# EAGLE design Register (EAGLE 9.6.2)
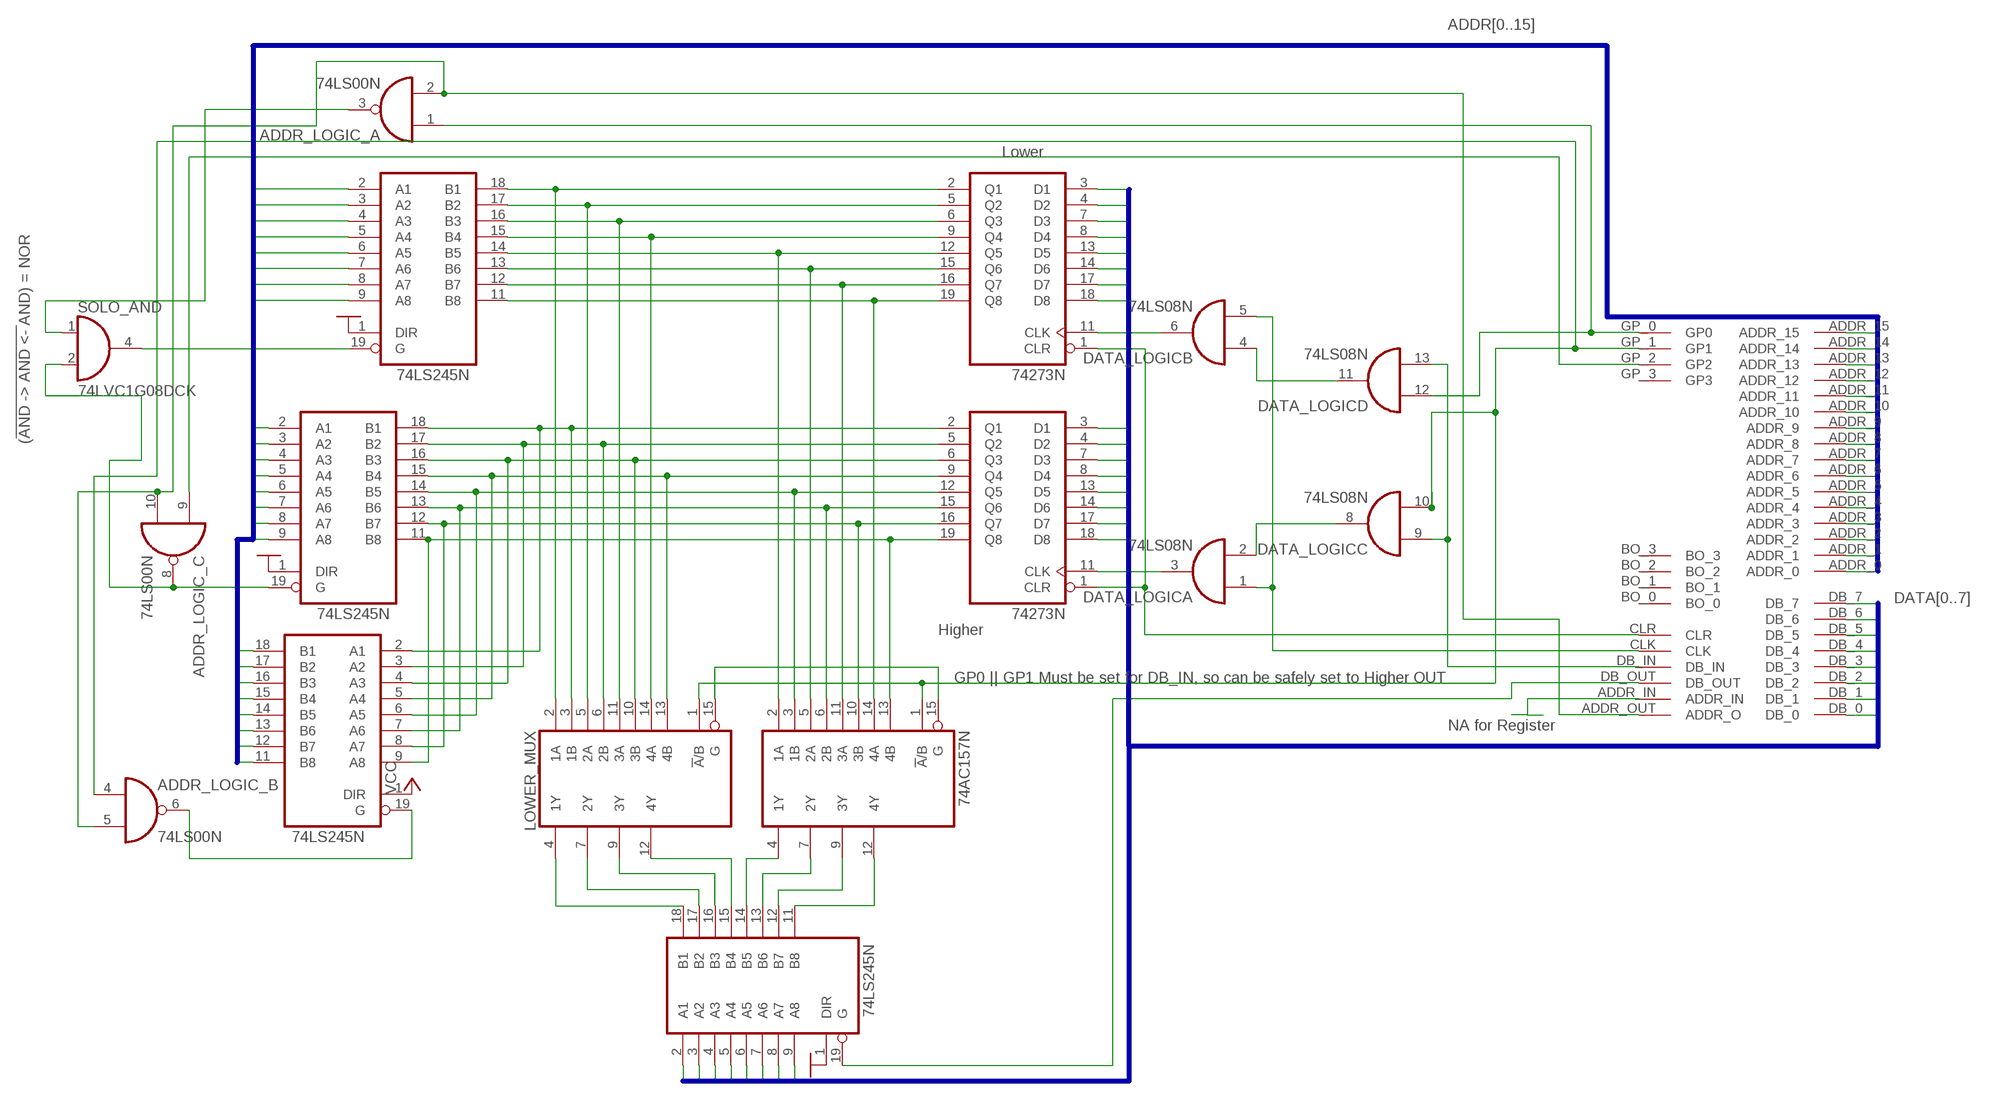
[diagram p0: schematic, sheet 1]

## Parts
ADDR_HIGHER_BUFFER  74LS245N  [DIL20]
ADDR_HIGHER_TO_LOWER  74LS245N  [DIL20]
ADDR_LOGIC_  74LS00N  [DIL14]
ADDR_LOWER_BUFFER  74LS245N  [DIL20]
DATA_LOGIC  74LS08N  [DIL14]
DATA_OUTPUT_BUFFER  74LS245N  [DIL20]
HIGHER_MUX  74AC157N  [DIL16]
LOWER_MUX  74AC157N  [DIL16]
REG_HIGHER  74273N  [DIL20]
REG_LOWER  74273N  [DIL20]
SOLO_AND  74LVC1G08DCK  [SC70-5]
U$1  BACKPLATE_INTERFACEEDGE_FINGER  [BACK_INTERFACE-FOOT]

## Nets
ADDR0: ADDR_HIGHER_TO_LOWER.18(B1) ADDR_LOWER_BUFFER.2(A1) U$1.ADDR_0
ADDR1: ADDR_HIGHER_TO_LOWER.17(B2) ADDR_LOWER_BUFFER.3(A2) U$1.ADDR_1
ADDR2: ADDR_HIGHER_TO_LOWER.16(B3) ADDR_LOWER_BUFFER.4(A3) U$1.ADDR_2
ADDR3: ADDR_HIGHER_TO_LOWER.15(B4) ADDR_LOWER_BUFFER.5(A4) U$1.ADDR_3
ADDR4: ADDR_HIGHER_TO_LOWER.14(B5) ADDR_LOWER_BUFFER.6(A5) U$1.ADDR_4
ADDR5: ADDR_HIGHER_TO_LOWER.13(B6) ADDR_LOWER_BUFFER.7(A6) U$1.ADDR_5
ADDR6: ADDR_HIGHER_TO_LOWER.12(B7) ADDR_LOWER_BUFFER.8(A7) U$1.ADDR_6
ADDR7: ADDR_HIGHER_TO_LOWER.11(B8) ADDR_LOWER_BUFFER.9(A8) U$1.ADDR_7
ADDR8: ADDR_HIGHER_BUFFER.2(A1) U$1.ADDR_8
ADDR9: ADDR_HIGHER_BUFFER.3(A2) U$1.ADDR_9
ADDR10: ADDR_HIGHER_BUFFER.4(A3) U$1.ADDR_10
ADDR11: ADDR_HIGHER_BUFFER.5(A4) U$1.ADDR_11
ADDR12: ADDR_HIGHER_BUFFER.6(A5) U$1.ADDR_12
ADDR13: ADDR_HIGHER_BUFFER.7(A6) U$1.ADDR_13
ADDR14: ADDR_HIGHER_BUFFER.8(A7) U$1.ADDR_14
ADDR15: ADDR_HIGHER_BUFFER.9(A8) U$1.ADDR_15
CLK: DATA_LOGIC.1(A:I0) DATA_LOGIC.5(B:I1) U$1.CLK
CLR: REG_HIGHER.1(CLR) REG_LOWER.1(CLR) U$1.CLR
CTRL_ADDR_OUT: ADDR_LOGIC_.2(A:I1) ADDR_LOGIC_.5(B:I1) ADDR_LOGIC_.10(C:I1) U$1.ADDR_OUT(ADDR_O)
CTRL_DB_IN: DATA_LOGIC.9(C:I0) DATA_LOGIC.13(D:I1) U$1.DB_IN
CTRL_DB_OUT: DATA_OUTPUT_BUFFER.19(G) U$1.DB_OUT
DATA0: DATA_OUTPUT_BUFFER.2(A1) REG_HIGHER.3(D1) REG_LOWER.3(D1) U$1.DB_0
DATA1: DATA_OUTPUT_BUFFER.3(A2) REG_HIGHER.4(D2) REG_LOWER.4(D2) U$1.DB_1
DATA2: DATA_OUTPUT_BUFFER.4(A3) REG_HIGHER.7(D3) REG_LOWER.7(D3) U$1.DB_2
DATA3: DATA_OUTPUT_BUFFER.5(A4) REG_HIGHER.8(D4) REG_LOWER.8(D4) U$1.DB_3
DATA4: DATA_OUTPUT_BUFFER.6(A5) REG_HIGHER.13(D5) REG_LOWER.13(D5) U$1.DB_4
DATA5: DATA_OUTPUT_BUFFER.7(A6) REG_HIGHER.14(D6) REG_LOWER.14(D6) U$1.DB_5
DATA6: DATA_OUTPUT_BUFFER.8(A7) REG_HIGHER.17(D7) REG_LOWER.17(D7) U$1.DB_6
DATA7: DATA_OUTPUT_BUFFER.9(A8) REG_HIGHER.18(D8) REG_LOWER.18(D8) U$1.DB_7
DATA_0: ADDR_LOWER_BUFFER.18(B1) LOWER_MUX.2(1A) REG_LOWER.2(Q1)
DATA_1: ADDR_LOWER_BUFFER.17(B2) LOWER_MUX.5(2A) REG_LOWER.5(Q2)
DATA_2: ADDR_LOWER_BUFFER.16(B3) LOWER_MUX.11(3A) REG_LOWER.6(Q3)
DATA_3: ADDR_LOWER_BUFFER.15(B4) LOWER_MUX.14(4A) REG_LOWER.9(Q4)
DATA_4: ADDR_LOWER_BUFFER.14(B5) HIGHER_MUX.2(1A) REG_LOWER.12(Q5)
DATA_5: ADDR_LOWER_BUFFER.13(B6) HIGHER_MUX.5(2A) REG_LOWER.15(Q6)
DATA_6: ADDR_LOWER_BUFFER.12(B7) HIGHER_MUX.11(3A) REG_LOWER.16(Q7)
DATA_7: ADDR_LOWER_BUFFER.11(B8) HIGHER_MUX.14(4A) REG_LOWER.19(Q8)
DATA_8: ADDR_HIGHER_BUFFER.18(B1) ADDR_HIGHER_TO_LOWER.2(A1) LOWER_MUX.3(1B) REG_HIGHER.2(Q1)
DATA_9: ADDR_HIGHER_BUFFER.17(B2) ADDR_HIGHER_TO_LOWER.3(A2) LOWER_MUX.6(2B) REG_HIGHER.5(Q2)
DATA_10: ADDR_HIGHER_BUFFER.16(B3) ADDR_HIGHER_TO_LOWER.4(A3) LOWER_MUX.10(3B) REG_HIGHER.6(Q3)
DATA_11: ADDR_HIGHER_BUFFER.15(B4) ADDR_HIGHER_TO_LOWER.5(A4) LOWER_MUX.13(4B) REG_HIGHER.9(Q4)
DATA_12: ADDR_HIGHER_BUFFER.14(B5) ADDR_HIGHER_TO_LOWER.6(A5) HIGHER_MUX.3(1B) REG_HIGHER.12(Q5)
DATA_13: ADDR_HIGHER_BUFFER.13(B6) ADDR_HIGHER_TO_LOWER.7(A6) HIGHER_MUX.6(2B) REG_HIGHER.15(Q6)
DATA_14: ADDR_HIGHER_BUFFER.12(B7) ADDR_HIGHER_TO_LOWER.8(A7) HIGHER_MUX.10(3B) REG_HIGHER.16(Q7)
DATA_15: ADDR_HIGHER_BUFFER.11(B8) ADDR_HIGHER_TO_LOWER.9(A8) HIGHER_MUX.13(4B) REG_HIGHER.19(Q8)
GND: ADDR_HIGHER_BUFFER.1(DIR) ADDR_LOWER_BUFFER.1(DIR) DATA_OUTPUT_BUFFER.1(DIR)
GP_0: ADDR_LOGIC_.1(A:I0) DATA_LOGIC.12(D:I0) U$1.GP_0(GP0)
GP_1: ADDR_LOGIC_.4(B:I0) DATA_LOGIC.10(C:I1) HIGHER_MUX.1(!A!/B) LOWER_MUX.1(!A!/B) U$1.GP_1(GP1)
GP_2: ADDR_LOGIC_.9(C:I0) U$1.GP_2(GP2)
N$2: DATA_OUTPUT_BUFFER.18(B1) LOWER_MUX.4(1Y)
N$3: DATA_OUTPUT_BUFFER.17(B2) LOWER_MUX.7(2Y)
N$4: DATA_LOGIC.6(B:O) REG_LOWER.11(CLK)
N$5: DATA_LOGIC.3(A:O) REG_HIGHER.11(CLK)
N$6: DATA_LOGIC.4(B:I0) DATA_LOGIC.11(D:O)
N$7: DATA_LOGIC.2(A:I1) DATA_LOGIC.8(C:O)
N$24: DATA_OUTPUT_BUFFER.16(B3) LOWER_MUX.9(3Y)
N$26: DATA_OUTPUT_BUFFER.15(B4) LOWER_MUX.12(4Y)
N$28: DATA_OUTPUT_BUFFER.14(B5) HIGHER_MUX.4(1Y)
N$29: U$1.ADDR_IN
N$30: DATA_OUTPUT_BUFFER.13(B6) HIGHER_MUX.7(2Y)
N$31: DATA_OUTPUT_BUFFER.12(B7) HIGHER_MUX.9(3Y)
N$32: DATA_OUTPUT_BUFFER.11(B8) HIGHER_MUX.12(4Y)
N$34: ADDR_HIGHER_TO_LOWER.19(G) ADDR_LOGIC_.6(B:O)
N$35: HIGHER_MUX.15(G) LOWER_MUX.15(G)
N$38: ADDR_HIGHER_BUFFER.19(G) ADDR_LOGIC_.8(C:O) SOLO_AND.2(I1)
N$39: ADDR_LOGIC_.3(A:O) SOLO_AND.1(I0)
N$41: ADDR_LOWER_BUFFER.19(G) SOLO_AND.4(O)
VCC: ADDR_HIGHER_TO_LOWER.1(DIR)
Unconnected: ADDR_LOGIC_.11(D:O) ADDR_LOGIC_.12(D:I0) ADDR_LOGIC_.13(D:I1) U$1.BO_0 U$1.BO_1 U$1.BO_2 U$1.BO_3 U$1.GP_3(GP3) U$1.NC_0 U$1.NC_1 U$1.NC_2 U$1.NC_3 U$1.NC_4 U$1.NC_5 U$1.NC_6 U$1.NC_7 U$1.NC_8 U$1.NC_9 U$1.NC_10 U$1.NC_11 U$1.NC_12 U$1.NC_13 U$1.NC_14 U$1.NC_15 U$1.NC_16 U$1.NC_17 U$1.NC_18 U$1.NC_19 U$1.NC_20 U$1.NC_21

## Buses
DATA[0..7]
ADDR[0..15]

## Notes on the sheet
- Lower
- (!AND -> AND <- !AND) = NOR
- Higher
- GP0 || GP1 Must be set for DB_IN, so can be safely set to Higher OUT
- NA for Register

## Power pins joined to a net without a drawn wire
GND: ADDR_HIGHER_BUFFER.10(GND) ADDR_HIGHER_TO_LOWER.10(GND) ADDR_LOGIC_.7(P:GND) ADDR_LOWER_BUFFER.10(GND) DATA_LOGIC.7(P:GND) DATA_OUTPUT_BUFFER.10(GND) HIGHER_MUX.8(GND) LOWER_MUX.8(GND) REG_HIGHER.10(GND) REG_LOWER.10(GND) SOLO_AND.3(GND) U$1.GND_0(GND) U$1.GND_1(GND)
VCC: ADDR_HIGHER_BUFFER.20(VCC) ADDR_HIGHER_TO_LOWER.20(VCC) ADDR_LOGIC_.14(P:VCC) ADDR_LOWER_BUFFER.20(VCC) DATA_LOGIC.14(P:VCC) DATA_OUTPUT_BUFFER.20(VCC) HIGHER_MUX.16(VCC) LOWER_MUX.16(VCC) REG_HIGHER.20(VCC) REG_LOWER.20(VCC) SOLO_AND.5(VCC) U$1.VCC_0(VCC) U$1.VCC_1(VCC)

## Library data of the parts
ADDR_HIGHER_BUFFER ADDR_HIGHER_TO_LOWER ADDR_LOWER_BUFFER DATA_OUTPUT_BUFFER = 74xx-eu:74*245: Octal BUS TRANSCEIVER, 3-state
ADDR_LOGIC_ = 74xx-eu:74*00: Quad 2-input NAND gate
DATA_LOGIC = 74xx-eu:74*08: Quad 2-input AND gate
HIGHER_MUX LOWER_MUX = 74xx-eu:74*157: Quadruple 2-line to 1-line data SELECTOR/MULTIPLEXER
REG_HIGHER REG_LOWER = 74xx-eu:74*273: Octal D type FLIP FLOP, clear
SOLO_AND = 74xx-little-de:74*1G08: 2-input AND gate
U$1 = Computer:BACKPLATE_INTERFACE

## Board
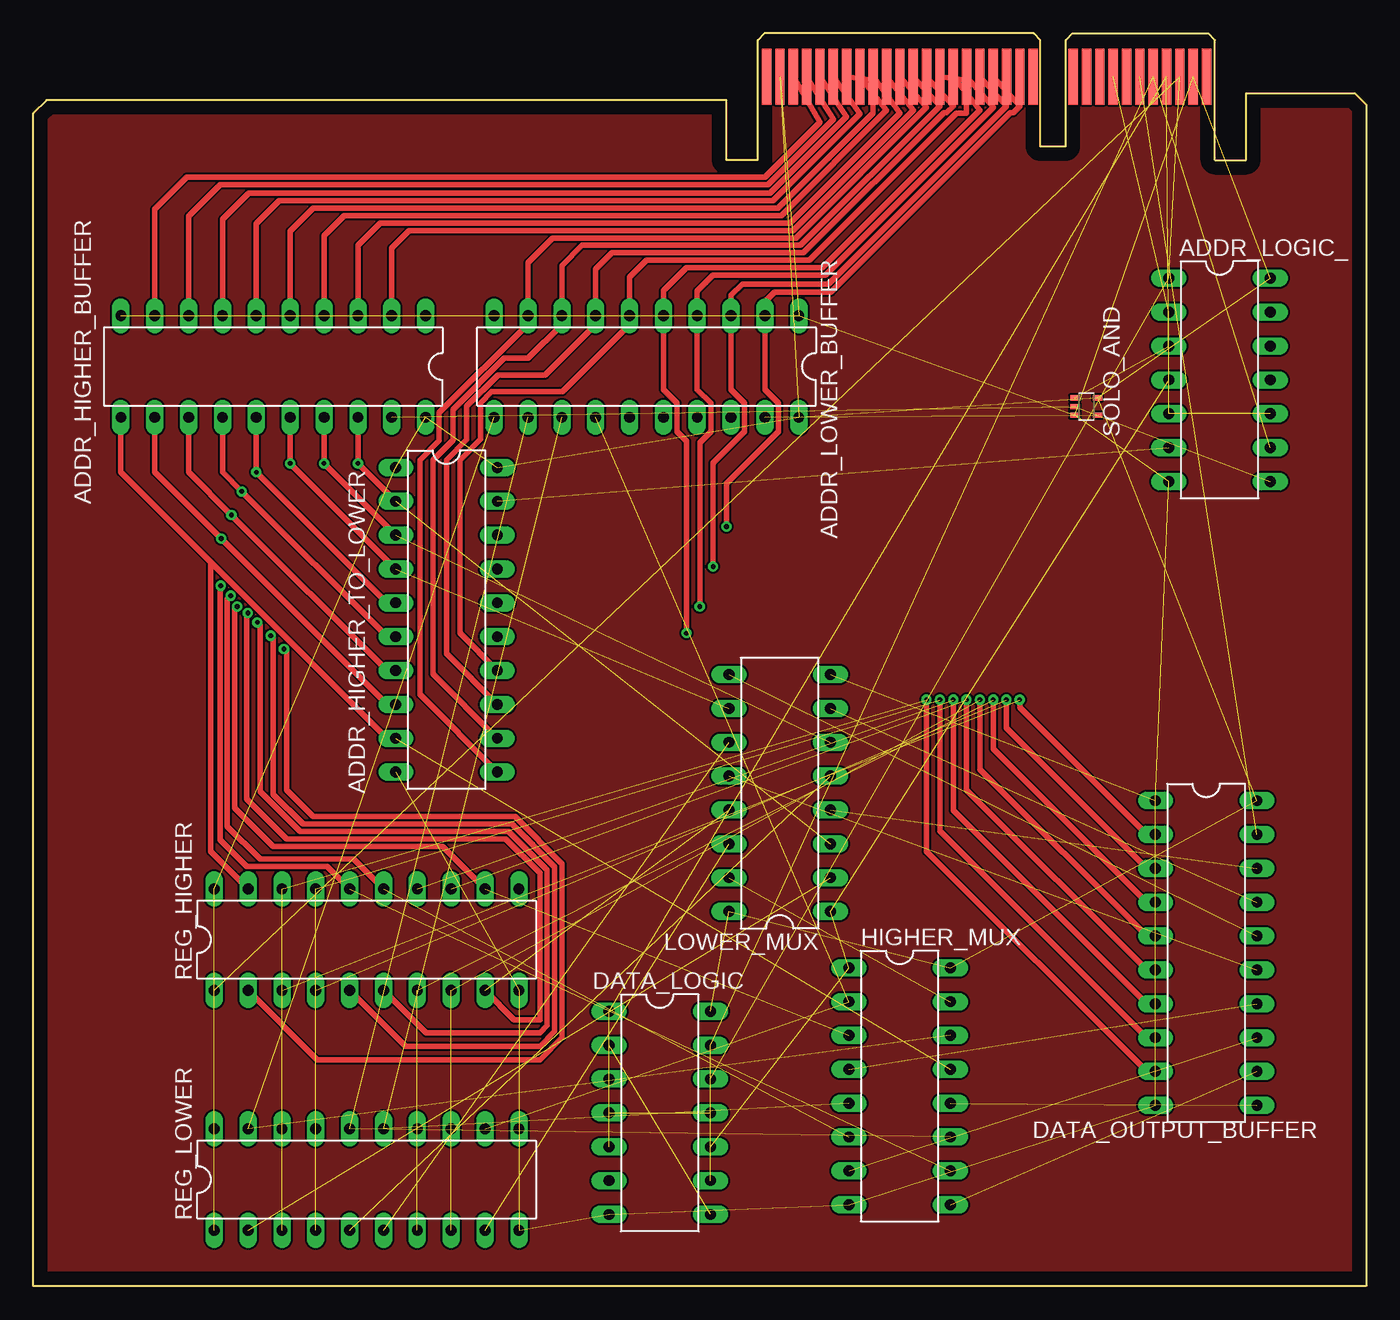
[diagram p1: board, top side]
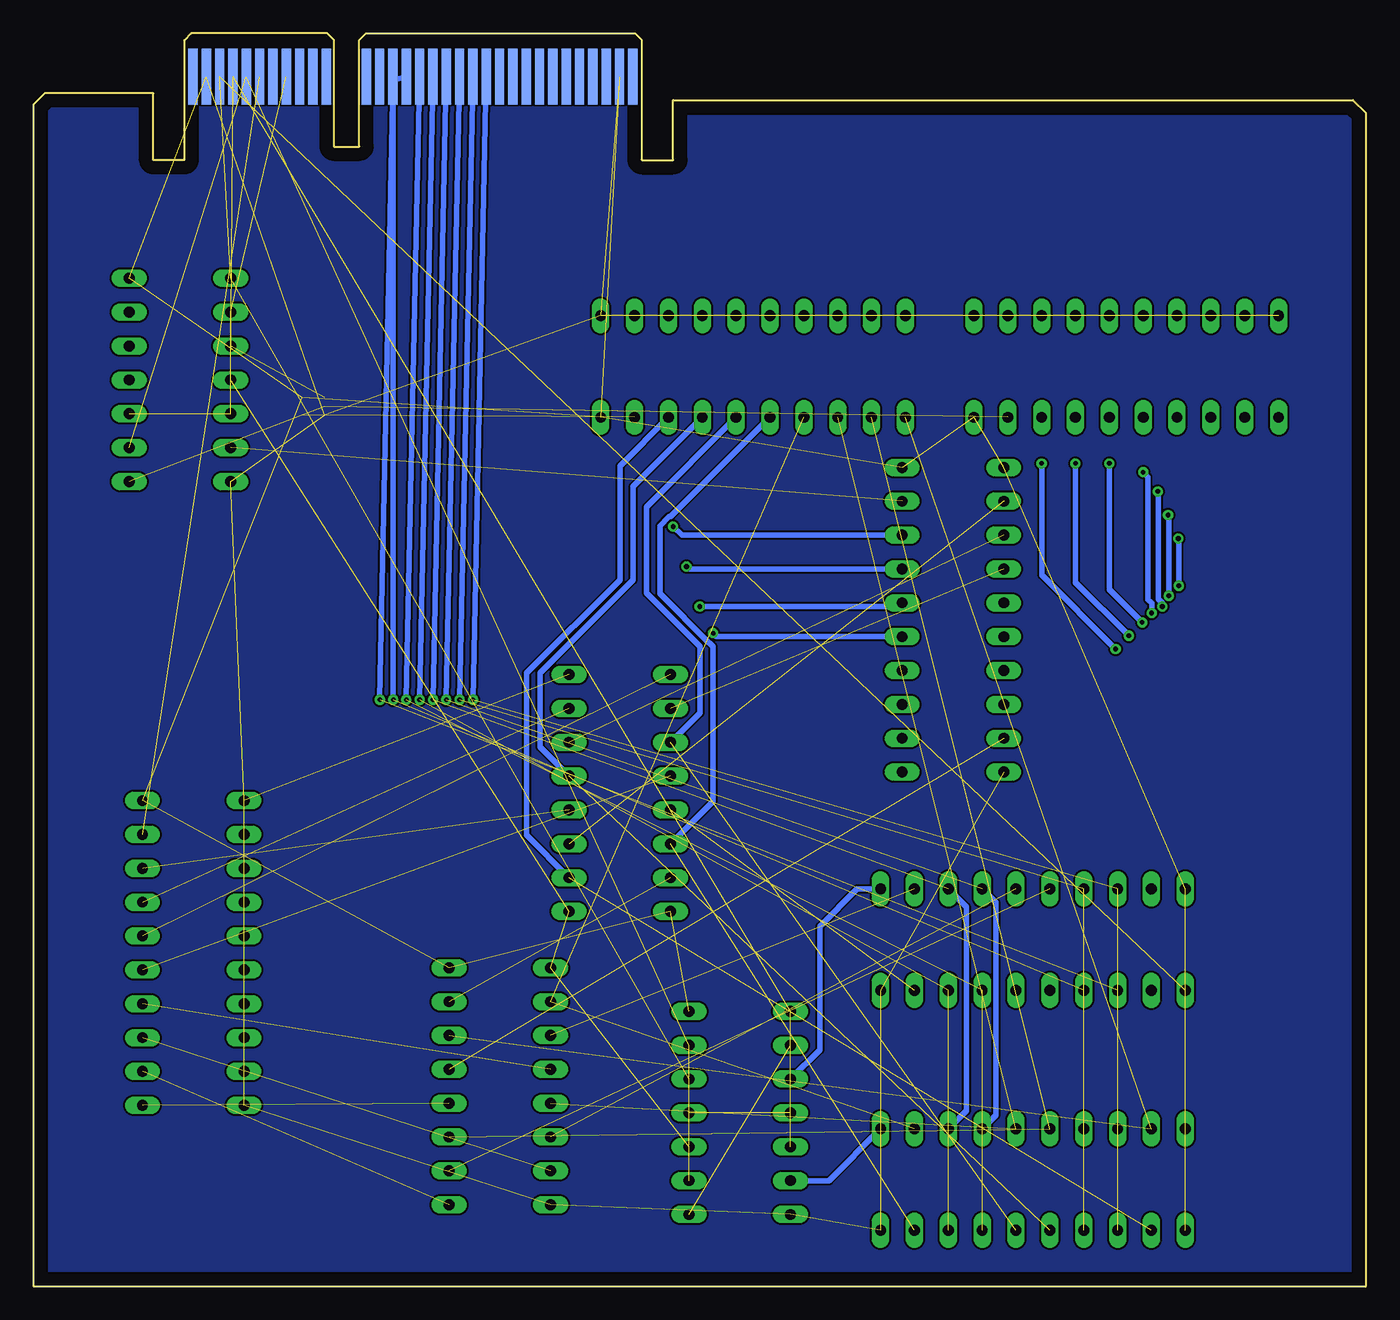
[diagram p2: board, bottom side, seen from below]

Size 100 x 94 mm. Coordinates in mm from the lower left corner, seen from the top.
Outline: 0,0 0,88 1,89 52,89 52,84.5 54.35,84.5 54.35,93.5 54.85,94 75.05,94 75.55,93.5 75.55,85.5 77.45,85.5 77.45,93.5 77.95,94 88.15,94 88.65,93.5 88.65,84.5 91,84.5 91,89.5 99.15,89.5 100,88.65 100,0 0,0
Copper layers (1+2*15+16): Top 0.035mm / dielectric 1.5mm / Route2 0.035mm / dielectric 0.15mm / Route15 0.035mm / dielectric 0.2mm / Bottom 0.035mm
Design rules "default *": minimum track width 16mil, minimum drill 0.35mm, track to track 6mil, track to pad 6mil, pad to pad 6mil, via to via 6mil, smd to smd 6mil, copper to edge 40mil, drill to drill 6mil, minimum pad ring 10mil, minimum via ring 8mil, stop-mask expansion 4mil, vias tented up to drill 0mil, thermal gap 10mil

### Footprints (pad centres in the part's own frame; a part is rotated, then mirrored left to right if it is on the bottom)
DIL20 = drill 0.813 long: 1 -11.43,-3.81; 2 -8.89,-3.81; 3 -6.35,-3.81; 4 -3.81,-3.81; 5 -1.27,-3.81; 6 1.27,-3.81; 7 3.81,-3.81; 8 6.35,-3.81; 9 8.89,-3.81; 10 11.43,-3.81; 11 11.43,3.81; 12 8.89,3.81; 13 6.35,3.81; 14 3.81,3.81; 15 1.27,3.81; 16 -1.27,3.81; 17 -3.81,3.81; 18 -6.35,3.81; 19 -8.89,3.81; 20 -11.43,3.81
DIL14 = drill 0.813 long: 1 -7.62,-3.81; 2 -5.08,-3.81; 3 -2.54,-3.81; 4 0,-3.81; 5 2.54,-3.81; 6 5.08,-3.81; 7 7.62,-3.81; 8 7.62,3.81; 9 5.08,3.81; 10 2.54,3.81; 11 0,3.81; 12 -2.54,3.81; 13 -5.08,3.81; 14 -7.62,3.81
DIL16 = drill 0.813 long: 1 -8.89,-3.81; 2 -6.35,-3.81; 3 -3.81,-3.81; 4 -1.27,-3.81; 5 1.27,-3.81; 6 3.81,-3.81; 7 6.35,-3.81; 8 8.89,-3.81; 9 8.89,3.81; 10 6.35,3.81; 11 3.81,3.81; 12 1.27,3.81; 13 -1.27,3.81; 14 -3.81,3.81; 15 -6.35,3.81; 16 -8.89,3.81
SC70-5 = smd 0.4 x 0.7: 1 -0.65,-0.85; 2 0,-0.85; 3 0.65,-0.85; 4 0.65,0.85; 5 -0.65,0.85
BACK_INTERFACE-FOOT = smd 0.7 x 4.2: ADDR_0 17.02,0; ADDR_1 16.02,0; ADDR_2 15.02,0; ADDR_3 14.02,0; ADDR_4 13.02,0; ADDR_5 12.02,0; ADDR_6 11.02,0; ADDR_7 10.02,0; ADDR_8 9.02,0; ADDR_9 8.02,0; ADDR_10 7.02,0; ADDR_11 6.02,0; ADDR_12 5.02,0; ADDR_13 4.02,0; ADDR_14 3.02,0; ADDR_15 2.02,0; ADDR_IN 27.02,0; ADDR_OUT 26.02,0; CLK 30.02,0; CLR 31.02,0; DB_IN 29.02,0; DB_OUT 28.02,0; GND_0 32.02,0; GND_1 1.02,0; NC_0 33.02,0; NC_1 25.02,0; NC_2 24.02,0; NC_3 23.02,0; NC_4 20.02,0; NC_5 19.02,0; NC_6 18.02,0; NC_7 0.02,0 | smd 0.7 x 4.2 bottom: BO_0 27.02,0; BO_1 26.02,0; BO_2 25.02,0; BO_3 24.02,0; DB_0 18.02,0; DB_1 17.02,0; DB_2 16.02,0; DB_3 15.02,0; DB_4 14.02,0; DB_5 13.02,0; DB_6 12.02,0; DB_7 11.02,0; GP_0 31.02,0; GP_1 30.02,0; GP_2 29.02,0; GP_3 28.02,0; NC_8 33.02,0; NC_9 23.02,0; NC_10 20.02,0; NC_11 19.02,0; NC_12 10.02,0; NC_13 9.02,0; NC_14 8.02,0; NC_15 7.02,0; NC_16 6.02,0; NC_17 5.02,0; NC_18 4.02,0; NC_19 3.02,0; NC_20 2.02,0; NC_21 0.02,0; VCC_0 32.02,0; VCC_1 1.02,0

### Placement (x,y rotation side)
ADDR_HIGHER_BUFFER  18,69 180 top
ADDR_HIGHER_TO_LOWER  31,50 270 top
ADDR_LOGIC_  89,68 270 top
ADDR_LOWER_BUFFER  46,69 180 top
DATA_LOGIC  47,13 270 top
DATA_OUTPUT_BUFFER  88,25 270 top
HIGHER_MUX  65,15 270 top
LOWER_MUX  56,37 90 top
REG_HIGHER  25,26 0 top
REG_LOWER  25,8 0 top
SOLO_AND  79,66 270 top
U$1  55,90.75 0 top

### Tracks (layer width: path | path; a pad name or v marks a point on that pad's centre or on a via)
ADDR0  (via drill 0.35)
  Top 0.406: U$1.ADDR_0 74.02,88.55 73.52,88.04 73.31,88.04 59.85,74.59 55.59,74.59 55,74 55,72.92 ADDR_LOWER_BUFFER.2 54.89,67.29 55.91,66.27 55.91,64.11 52,60.2 v52,57
  Bottom 0.406: v52,57 51.35,56.35 ADDR_HIGHER_TO_LOWER.18
ADDR1  (via drill 0.35)
  Top 0.406: U$1.ADDR_1 73.02,88.55 59.67,75.2 53.2,75.2 52.35,74.35 ADDR_LOWER_BUFFER.3 52.35,67.29 53.37,66.27 53.37,64.11 51,61.74 v51,54
  Bottom 0.406: v51,54 50.81,53.81 ADDR_HIGHER_TO_LOWER.17
ADDR2  (via drill 0.35)
  Top 0.406: U$1.ADDR_2 72.02,88.44 59.43,75.85 51,75.85 49.81,74.66 ADDR_LOWER_BUFFER.4 49.81,67.29 50.83,66.27 50.83,64.11 50,63.28 v50,51
  Bottom 0.406: v50,51 35.08,51 ADDR_HIGHER_TO_LOWER.16
ADDR3  (via drill 0.35)
  Top 0.406: U$1.ADDR_3 71.02,88.23 59.2,76.41 49,76.41 47.27,74.68 ADDR_LOWER_BUFFER.5 47.27,67.29 48.29,66.27 48.29,64.11 49,63.4 v49,49
  Bottom 0.406: v49,49 48.73,48.73 ADDR_HIGHER_TO_LOWER.15
ADDR4
  Top 0.406: U$1.ADDR_4 70,90.48 70,88 69.26,88 58.23,76.97 46,76.97 44.73,75.7 ADDR_LOWER_BUFFER.6 44.73,72.15 39.69,67.11 34.39,67.11 33.54,66.26 33.54,63.54 32,62 32,49 ADDR_HIGHER_TO_LOWER.14
ADDR5
  Top 0.406: U$1.ADDR_5 69.02,88.55 68.52,88.04 68.31,88.04 57.79,77.53 43.41,77.53 42.19,76.31 ADDR_LOWER_BUFFER.7 42.19,72.15 38.41,68.37 34.86,68.37 32.51,66.02 32.51,63.51 31,62 31,47.46 ADDR_HIGHER_TO_LOWER.13
ADDR6
  Top 0.406: U$1.ADDR_6 68.02,88.55 57.56,78.09 41.18,78.09 39.65,76.56 ADDR_LOWER_BUFFER.8 39.65,72.15 37.13,69.63 35.33,69.63 31.49,65.78 31.49,63.49 30,62 30,45.92 ADDR_HIGHER_TO_LOWER.12
ADDR7
  Top 0.406: U$1.ADDR_7 67.02,88.44 57.23,78.65 38.95,78.65 37.11,76.81 ADDR_LOWER_BUFFER.9 37.11,72.2 30.46,65.55 30.46,63.46 29,62 29,44.38 ADDR_HIGHER_TO_LOWER.11
ADDR8
  Top 0.406: ADDR_HIGHER_BUFFER.2 26.89,77.89 28.21,79.21 57,79.21 66.02,88.23 U$1.ADDR_8
ADDR9
  Top 0.406: U$1.ADDR_9 65.02,88.02 56.77,79.77 26,79.77 24.35,78.11 ADDR_HIGHER_BUFFER.3
ADDR10
  Top 0.406: ADDR_HIGHER_BUFFER.4 21.81,78.81 23.32,80.32 56.11,80.32 64.02,88.23 U$1.ADDR_10
ADDR11
  Top 0.406: U$1.ADDR_11 63,90.48 63,88 55.88,80.88 21,80.88 19.27,79.15 ADDR_HIGHER_BUFFER.5
ADDR12
  Top 0.406: ADDR_HIGHER_BUFFER.6 16.73,79.73 18.44,81.44 55.49,81.44 62.02,87.97 U$1.ADDR_12
ADDR13
  Top 0.406: U$1.ADDR_13 61.02,87.76 55.26,82 16.14,82 14.19,80.05 ADDR_HIGHER_BUFFER.7
ADDR14
  Top 0.406: ADDR_HIGHER_BUFFER.8 11.65,80.3 14,82.65 55.12,82.65 60.02,87.55 U$1.ADDR_14
ADDR15
  Top 0.406: ADDR_HIGHER_BUFFER.9 9.11,80.81 11.51,83.2 54.89,83.2 59.02,87.34 U$1.ADDR_15
CLK  (2 unrouted)
CLR  (2 unrouted)
CTRL_ADDR_OUT  (3 unrouted)
CTRL_DB_IN  (2 unrouted)
CTRL_DB_OUT  (1 unrouted)
DATA0  (via drill 0.35)  (2 unrouted)
  Top 0.406: DATA_OUTPUT_BUFFER.2 83.53,33.89 74,43.42 v74,44
  Bottom 0.406: U$1.DB_0 74.02,44.02 v74,44
DATA1  (via drill 0.35)  (2 unrouted)
  Top 0.406: DATA_OUTPUT_BUFFER.3 83.53,31.35 73,41.88 v73,44
  Bottom 0.406: v73,44 73,90.48 U$1.DB_1
DATA2  (via drill 0.35)  (2 unrouted)
  Top 0.406: DATA_OUTPUT_BUFFER.4 83.53,28.81 72.02,40.32 v72.02,44
  Bottom 0.406: U$1.DB_2 v72.02,44
DATA3  (via drill 0.35)  (2 unrouted)
  Top 0.406: DATA_OUTPUT_BUFFER.5 83.53,26.27 71.02,38.78 v71.02,44
  Bottom 0.406: U$1.DB_3 v71.02,44
DATA4  (via drill 0.35)  (1 unrouted)
  Top 0.406: DATA_OUTPUT_BUFFER.6 83.53,23.73 70.02,37.24 v70.02,44
  Bottom 0.406: U$1.DB_4 v70.02,44 | REG_LOWER.13 30,13.16 30,28.46 REG_HIGHER.13
DATA5  (via drill 0.35)  (1 unrouted)
  Top 0.406: DATA_OUTPUT_BUFFER.7 83.53,21.19 69.02,35.7 v69.02,44
  Bottom 0.406: U$1.DB_5 v69.02,44 | REG_HIGHER.14 27.79,28.79 27.79,12.83 REG_LOWER.14
DATA6  (via drill 0.35)  (2 unrouted)
  Top 0.406: DATA_OUTPUT_BUFFER.8 83.53,18.65 68.02,34.16 v68.02,44
  Bottom 0.406: U$1.DB_6 v68.02,44
DATA7  (via drill 0.35)  (2 unrouted)
  Top 0.406: DATA_OUTPUT_BUFFER.9 83.53,16.11 67.02,32.62 v67.02,44
  Bottom 0.406: U$1.DB_7 v67.02,44
DATA_0  (1 unrouted)
  Bottom 0.406: ADDR_LOWER_BUFFER.18 56,61.54 56,53 63,46 63,33.84 LOWER_MUX.2
DATA_1  (1 unrouted)
  Bottom 0.406: ADDR_LOWER_BUFFER.17 55,60 55,53 62,46 62,40.46 LOWER_MUX.5
DATA_2  (1 unrouted)
  Bottom 0.406: ADDR_LOWER_BUFFER.16 54,58.46 54,52 50,48 50,43 LOWER_MUX.11
DATA_3  (1 unrouted)
  Bottom 0.406: ADDR_LOWER_BUFFER.15 52.19,57.73 52.3,57.73 53,57.04 53,51.96 49.3,48.27 49.27,48.27 49,48 49,36.38 LOWER_MUX.14
DATA_4  (2 unrouted)
DATA_5  (2 unrouted)
DATA_6  (2 unrouted)
DATA_7  (2 unrouted)
DATA_8  (via drill 0.35)  (1 unrouted)
  Top 0.406: ADDR_HIGHER_BUFFER.18 v24.35,61.73 ADDR_HIGHER_TO_LOWER.2 | REG_HIGHER.2 21.3,17 38,17 39.68,18.68 39.68,31.69 36.14,35.23 21,35.23 19,37.23 19,47.6 v18.8,47.8
  Bottom 0.406: v18.8,47.8 24.35,53.35 v24.35,61.73
DATA_9  (via drill 0.35)  (1 unrouted)
  Top 0.406: ADDR_HIGHER_TO_LOWER.3 v21.81,61.73 ADDR_HIGHER_BUFFER.17 | REG_HIGHER.5 27.92,18 38,18 39.12,19.12 39.12,31.46 35.9,34.68 20.23,34.68 18,36.91 18,48.6 v17.8,48.8
  Bottom 0.406: v17.8,48.8 21.81,52.81 v21.81,61.73
DATA_10  (via drill 0.35)  (1 unrouted)
  Top 0.406: ADDR_HIGHER_TO_LOWER.4 v19.27,61.73 ADDR_HIGHER_BUFFER.16 | REG_HIGHER.6 29.46,19 38,19 38.56,19.56 38.56,31.23 35.67,34.12 20,34.12 17,37.12 17,49.6 v16.8,49.8
  Bottom 0.406: v16.8,49.8 19.27,52.27 v19.27,61.73
DATA_11  (via drill 0.35)  (1 unrouted)
  Top 0.406: ADDR_HIGHER_TO_LOWER.5 26.53,51.27 v16.73,61.07 ADDR_HIGHER_BUFFER.15 | REG_HIGHER.9 36.08,20 38,20 38,31 35.44,33.56 19,33.56 16,36.56 16,50.42 v16.09,50.51
  Bottom 0.406: v16.09,50.51 16.09,51.26 16.36,51.54 16.36,60.7 v16.73,61.07
DATA_12  (via drill 0.35)  (1 unrouted)
  Top 0.406: ADDR_HIGHER_TO_LOWER.6 26.53,48.73 v15.63,59.63 14.19,61.07 ADDR_HIGHER_BUFFER.14 | REG_HIGHER.12 30.7,33 18,33 15.12,35.88 15.12,50.83 v15.29,51
  Bottom 0.406: v15.29,51 15.29,51.26 15.59,51.56 15.59,59.59 v15.63,59.63
DATA_13  (via drill 0.35)  (1 unrouted)
  Top 0.406: ADDR_HIGHER_TO_LOWER.7 26.53,46.19 v14.86,57.86 11.65,61.07 ADDR_HIGHER_BUFFER.13 | REG_HIGHER.15 24.04,32.05 17,32.05 14.56,34.49 14.56,51.56 v14.8,51.8
  Bottom 0.406: v14.8,51.8 14.8,55.76 14.82,55.79 14.82,57.82 v14.86,57.86
DATA_14  (via drill 0.35)  (1 unrouted)
  Top 0.406: ADDR_HIGHER_TO_LOWER.8 26.53,43.65 v14.09,56.09 9.11,61.07 ADDR_HIGHER_BUFFER.12 | REG_HIGHER.16 22.05,31.49 16,31.49 14,33.49 14,52.49 v14.05,52.55
  Bottom 0.406: v14.05,52.55 14.05,56.05 v14.09,56.09
DATA_15  (1 unrouted)
  Top 0.406: ADDR_HIGHER_TO_LOWER.9 26.53,41.11 13.32,54.32 | 13.32,54.32 6.57,61.07 ADDR_HIGHER_BUFFER.11 | REG_HIGHER.19 13.32,32.6 13.32,54.32
GND  (15 unrouted)
GND1
  pour Top: 0,88 1,89 52,89 52,84.5 54.35,84.5 54.35,93.5 54.85,94 75.05,94 75.55,93.5 75.55,85.5 77.45,85.5 77.45,93.5 77.95,94 88.15,94 88.65,93.5 88.65,84.5 91,84.5 91,89.5 99.15,89.5 100,88.65 100,0 0,0
GP_0  (2 unrouted)
GP_1  (4 unrouted)
GP_2  (1 unrouted)
N$2  (1 unrouted)
N$3  (1 unrouted)
N$4
  Bottom 0.406: DATA_LOGIC.6 40.32,7.92 REG_LOWER.11
N$5
  Bottom 0.406: DATA_LOGIC.3 41,17.73 41,27 38.19,29.81 REG_HIGHER.11
N$6  (1 unrouted)
N$7  (1 unrouted)
N$24  (1 unrouted)
N$26  (1 unrouted)
N$28  (1 unrouted)
N$30  (1 unrouted)
N$31  (1 unrouted)
N$32  (1 unrouted)
N$34  (1 unrouted)
N$35  (1 unrouted)
N$38  (2 unrouted)
N$39  (1 unrouted)
N$41  (1 unrouted)
VCC  (13 unrouted)
VCC1
  pour Bottom: 0,88 1,89 52,89 52,84.5 54.35,84.5 54.35,93.5 54.85,94 75.05,94 75.55,93.5 75.55,85.5 77.45,85.5 77.45,93.5 77.95,94 88.15,94 88.65,93.5 88.65,84.5 91,84.5 91,89.5 99.15,89.5 100,88.65 100,0 0,0